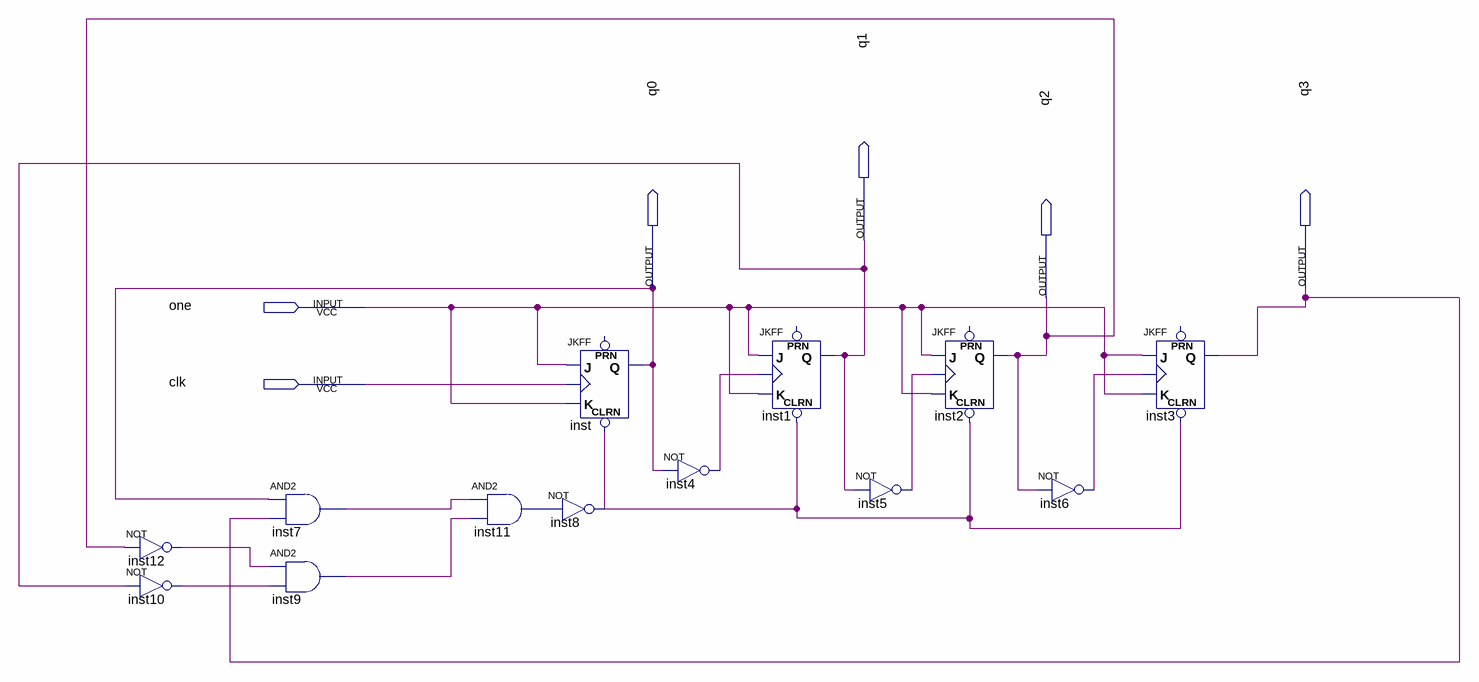
[diagram p0: schematic sheet]
// Quartus schematic teste1.bdf as structural Verilog: 13 symbols, 6 pins
module teste1 (
  input  one,
  input  clk,
  output q1,
  output q0,
  output q3,
  output q2
);

  wire inst4_out, inst5_out, inst6_out, inst7_out, inst8_out, inst9_out, inst10_out, inst11_out, inst12_out;

  not inst12 (inst12_out, q2);
  not inst10 (inst10_out, q1);
  and inst7 (inst7_out, q0, q3);
  and inst9 (inst9_out, inst12_out, inst10_out);
  and inst11 (inst11_out, inst7_out, inst9_out);
  JKFF inst (.CLRN(inst8_out), .K(one), .J(one), .CLK(clk), .Q(q0));  // open: PRN
  not inst8 (inst8_out, inst11_out);
  not inst4 (inst4_out, q0);
  JKFF inst1 (.CLRN(inst8_out), .K(one), .J(one), .CLK(inst4_out), .Q(q1));  // open: PRN
  not inst5 (inst5_out, q1);
  JKFF inst2 (.CLRN(inst8_out), .K(one), .J(one), .CLK(inst5_out), .Q(q2));  // open: PRN
  not inst6 (inst6_out, q2);
  JKFF inst3 (.CLRN(inst8_out), .K(one), .J(one), .CLK(inst6_out), .Q(q3));  // open: PRN
endmodule
